# EAGLE design prvosienka (EAGLE 9.5.2)
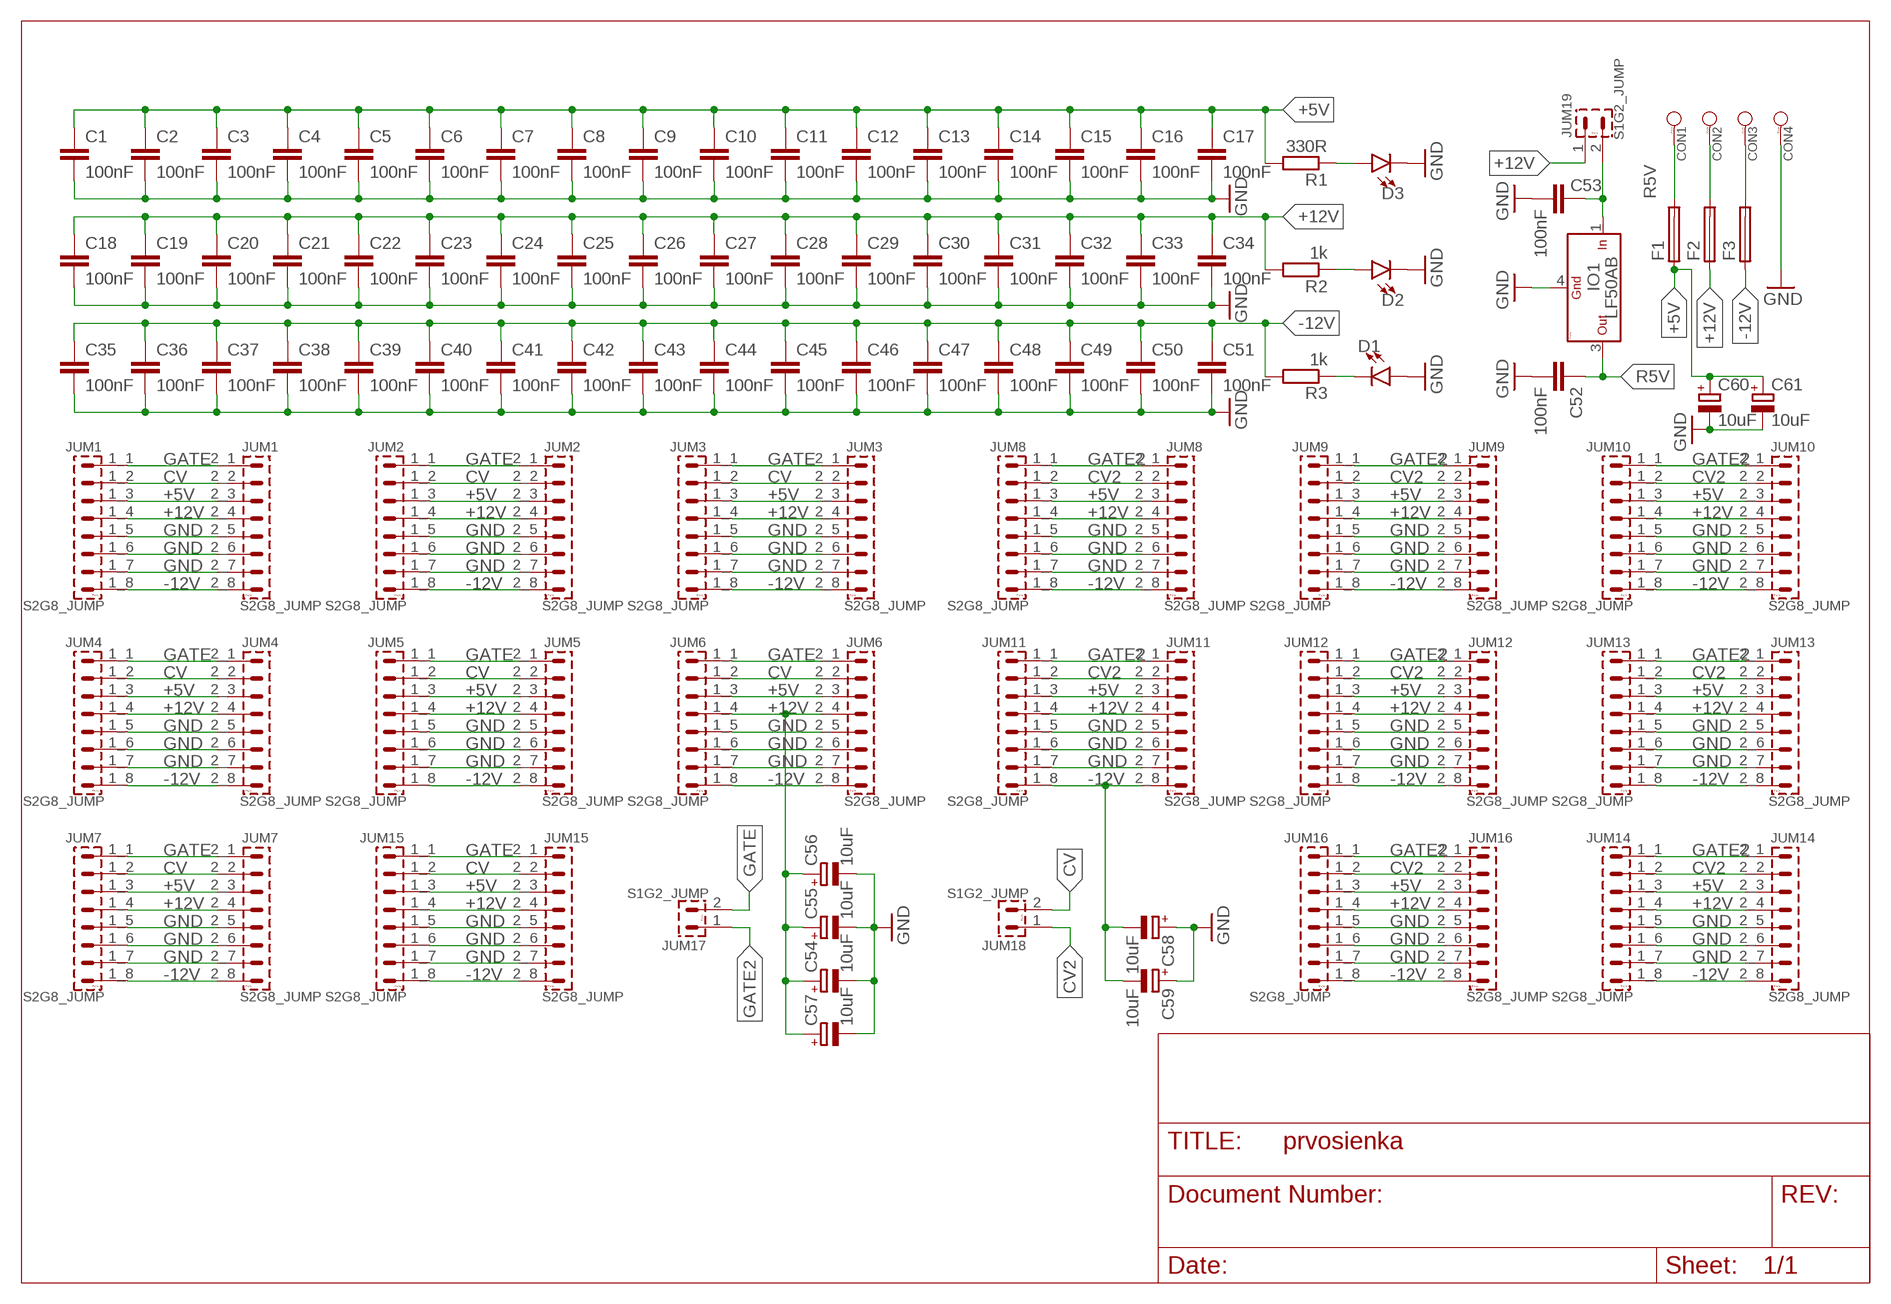
[diagram p0: schematic, sheet 1]

## Parts
C1  100nF  C-EUC0603K  [C0603K]
C2  100nF  C-EUC0603K  [C0603K]
C3  100nF  C-EUC0603K  [C0603K]
C4  100nF  C-EUC0603K  [C0603K]
C5  100nF  C-EUC0603K  [C0603K]
C6  100nF  C-EUC0603K  [C0603K]
C7  100nF  C-EUC0603K  [C0603K]
C8  100nF  C-EUC0603K  [C0603K]
C9  100nF  C-EUC0603K  [C0603K]
C10  100nF  C-EUC0603K  [C0603K]
C11  100nF  C-EUC0603K  [C0603K]
C12  100nF  C-EUC0603K  [C0603K]
C13  100nF  C-EUC0603K  [C0603K]
C14  100nF  C-EUC0603K  [C0603K]
C15  100nF  C-EUC0603K  [C0603K]
C16  100nF  C-EUC0603K  [C0603K]
C17  100nF  C-EUC0603K  [C0603K]
C18  100nF  C-EUC0603K  [C0603K]
C19  100nF  C-EUC0603K  [C0603K]
C20  100nF  C-EUC0603K  [C0603K]
C21  100nF  C-EUC0603K  [C0603K]
C22  100nF  C-EUC0603K  [C0603K]
C23  100nF  C-EUC0603K  [C0603K]
C24  100nF  C-EUC0603K  [C0603K]
C25  100nF  C-EUC0603K  [C0603K]
C26  100nF  C-EUC0603K  [C0603K]
C27  100nF  C-EUC0603K  [C0603K]
C28  100nF  C-EUC0603K  [C0603K]
C29  100nF  C-EUC0603K  [C0603K]
C30  100nF  C-EUC0603K  [C0603K]
C31  100nF  C-EUC0603K  [C0603K]
C32  100nF  C-EUC0603K  [C0603K]
C33  100nF  C-EUC0603K  [C0603K]
C34  100nF  C-EUC0603K  [C0603K]
C35  100nF  C-EUC0603K  [C0603K]
C36  100nF  C-EUC0603K  [C0603K]
C37  100nF  C-EUC0603K  [C0603K]
C38  100nF  C-EUC0603K  [C0603K]
C39  100nF  C-EUC0603K  [C0603K]
C40  100nF  C-EUC0603K  [C0603K]
C41  100nF  C-EUC0603K  [C0603K]
C42  100nF  C-EUC0603K  [C0603K]
C43  100nF  C-EUC0603K  [C0603K]
C44  100nF  C-EUC0603K  [C0603K]
C45  100nF  C-EUC0603K  [C0603K]
C46  100nF  C-EUC0603K  [C0603K]
C47  100nF  C-EUC0603K  [C0603K]
C48  100nF  C-EUC0603K  [C0603K]
C49  100nF  C-EUC0603K  [C0603K]
C50  100nF  C-EUC0603K  [C0603K]
C51  100nF  C-EUC0603K  [C0603K]
C52  100nF  C-EUC0603K  [C0603K]
C53  100nF  C-EUC0603K  [C0603K]
C54  10uF  CPOL-EUB  [PANASONIC_B]
C55  10uF  CPOL-EUB  [PANASONIC_B]
C56  10uF  CPOL-EUB  [PANASONIC_B]
C57  10uF  CPOL-EUB  [PANASONIC_B]
C58  10uF  CPOL-EUB  [PANASONIC_B]
C59  10uF  CPOL-EUB  [PANASONIC_B]
C60  10uF  CPOL-EUB  [PANASONIC_B]
C61  10uF  CPOL-EUB  [PANASONIC_B]
CON1  WAGO256  [WAGO256]
CON2  WAGO256  [WAGO256]
CON3  WAGO256  [WAGO256]
CON4  WAGO256  [WAGO256]
D1  LED0603  [LED-0603]
D2  LED0603  [LED-0603]
D3  LED0603  [LED-0603]
F1  TE5  [TE5]
F2  TE5  [TE5]
F3  TE5  [TE5]
IO1  LF50AB  78M  [DPAK]
JUM1  S2G8_JUMP  [S2G8_JUM]
JUM2  S2G8_JUMP  [S2G8_JUM]
JUM3  S2G8_JUMP  [S2G8_JUM]
JUM4  S2G8_JUMP  [S2G8_JUM]
JUM5  S2G8_JUMP  [S2G8_JUM]
JUM6  S2G8_JUMP  [S2G8_JUM]
JUM7  S2G8_JUMP  [S2G8_JUM]
JUM8  S2G8_JUMP  [S2G8_JUM]
JUM9  S2G8_JUMP  [S2G8_JUM]
JUM10  S2G8_JUMP  [S2G8_JUM]
JUM11  S2G8_JUMP  [S2G8_JUM]
JUM12  S2G8_JUMP  [S2G8_JUM]
JUM13  S2G8_JUMP  [S2G8_JUM]
JUM14  S2G8_JUMP  [S2G8_JUM]
JUM15  S2G8_JUMP  [S2G8_JUM]
JUM16  S2G8_JUMP  [S2G8_JUM]
JUM17  S1G2_JUMP  [S1G2_JUM]
JUM18  S1G2_JUMP  [S1G2_JUM]
JUM19  S1G2_JUMP  [S1G2_JUM]
R1  330R  R-EU_R0603  [R0603]
R2  1k  R-EU_R0603  [R0603]
R3  1k  R-EU_R0603  [R0603]

## Nets
+5V: C1.1 C2.1 C3.1 C4.1 C5.1 C6.1 C7.1 C8.1 C9.1 C10.1 C11.1 C12.1 C13.1 C14.1 C15.1 C16.1 C17.1 C60.+ C61.+ F1.1 JUM1.1_3 JUM1.2_3 JUM2.1_3 JUM2.2_3 JUM3.1_3 JUM3.2_3 JUM4.1_3 JUM4.2_3 JUM5.1_3 JUM5.2_3 JUM6.1_3 JUM6.2_3 JUM7.1_3 JUM7.2_3 JUM8.1_3 JUM8.2_3 JUM9.1_3 JUM9.2_3 JUM10.1_3 JUM10.2_3 JUM11.1_3 JUM11.2_3 JUM12.1_3 JUM12.2_3 JUM13.1_3 JUM13.2_3 JUM14.1_3 JUM14.2_3 JUM15.1_3 JUM15.2_3 JUM16.1_3 JUM16.2_3 R1.2
+12V: C18.1 C19.1 C20.1 C21.1 C22.1 C23.1 C24.1 C25.1 C26.1 C27.1 C28.1 C29.1 C30.1 C31.1 C32.1 C33.1 C34.1 C54.+ C55.+ C56.+ C57.+ F2.1 JUM1.1_4 JUM1.2_4 JUM2.1_4 JUM2.2_4 JUM3.1_4 JUM3.2_4 JUM4.1_4 JUM4.2_4 JUM5.1_4 JUM5.2_4 JUM6.1_4 JUM6.2_4 JUM7.1_4 JUM7.2_4 JUM8.1_4 JUM8.2_4 JUM9.1_4 JUM9.2_4 JUM10.1_4 JUM10.2_4 JUM11.1_4 JUM11.2_4 JUM12.1_4 JUM12.2_4 JUM13.1_4 JUM13.2_4 JUM14.1_4 JUM14.2_4 JUM15.1_4 JUM15.2_4 JUM16.1_4 JUM16.2_4 JUM19.1 R2.2
-12V: C35.1 C36.1 C37.1 C38.1 C39.1 C40.1 C41.1 C42.1 C43.1 C44.1 C45.1 C46.1 C47.1 C48.1 C49.1 C50.1 C51.1 C58.- C59.- F3.1 JUM1.1_8 JUM1.2_8 JUM2.1_8 JUM2.2_8 JUM3.1_8 JUM3.2_8 JUM4.1_8 JUM4.2_8 JUM5.1_8 JUM5.2_8 JUM6.1_8 JUM6.2_8 JUM7.1_8 JUM7.2_8 JUM8.1_8 JUM8.2_8 JUM9.1_8 JUM9.2_8 JUM10.1_8 JUM10.2_8 JUM11.1_8 JUM11.2_8 JUM12.1_8 JUM12.2_8 JUM13.1_8 JUM13.2_8 JUM14.1_8 JUM14.2_8 JUM15.1_8 JUM15.2_8 JUM16.1_8 JUM16.2_8 R3.2
CV: JUM1.1_2 JUM1.2_2 JUM2.1_2 JUM2.2_2 JUM3.1_2 JUM3.2_2 JUM4.1_2 JUM4.2_2 JUM5.1_2 JUM5.2_2 JUM6.1_2 JUM6.2_2 JUM7.1_2 JUM7.2_2 JUM15.1_2 JUM15.2_2 JUM18.2
CV2: JUM8.1_2 JUM8.2_2 JUM9.1_2 JUM9.2_2 JUM10.1_2 JUM10.2_2 JUM11.1_2 JUM11.2_2 JUM12.1_2 JUM12.2_2 JUM13.1_2 JUM13.2_2 JUM14.1_2 JUM14.2_2 JUM16.1_2 JUM16.2_2 JUM18.1
GATE: JUM1.1_1 JUM1.2_1 JUM2.1_1 JUM2.2_1 JUM3.1_1 JUM3.2_1 JUM4.1_1 JUM4.2_1 JUM5.1_1 JUM5.2_1 JUM6.1_1 JUM6.2_1 JUM7.1_1 JUM7.2_1 JUM15.1_1 JUM15.2_1 JUM17.2
GATE2: JUM8.1_1 JUM8.2_1 JUM9.1_1 JUM9.2_1 JUM10.1_1 JUM10.2_1 JUM11.1_1 JUM11.2_1 JUM12.1_1 JUM12.2_1 JUM13.1_1 JUM13.2_1 JUM14.1_1 JUM14.2_1 JUM16.1_1 JUM16.2_1 JUM17.1
GND: C1.2 C2.2 C3.2 C4.2 C5.2 C6.2 C7.2 C8.2 C9.2 C10.2 C11.2 C12.2 C13.2 C14.2 C15.2 C16.2 C17.2 C18.2 C19.2 C20.2 C21.2 C22.2 C23.2 C24.2 C25.2 C26.2 C27.2 C28.2 C29.2 C30.2 C31.2 C32.2 C33.2 C34.2 C35.2 C36.2 C37.2 C38.2 C39.2 C40.2 C41.2 C42.2 C43.2 C44.2 C45.2 C46.2 C47.2 C48.2 C49.2 C50.2 C51.2 C52.2 C53.2 C54.- C55.- C56.- C57.- C58.+ C59.+ C60.- C61.- CON4.1 D1.A D2.C D3.C IO1.4(GND) JUM1.1_5 JUM1.1_6 JUM1.1_7 JUM1.2_5 JUM1.2_6 JUM1.2_7 JUM2.1_5 JUM2.1_6 JUM2.1_7 JUM2.2_5 JUM2.2_6 JUM2.2_7 JUM3.1_5 JUM3.1_6 JUM3.1_7 JUM3.2_5 JUM3.2_6 JUM3.2_7 JUM4.1_5 JUM4.1_6 JUM4.1_7 JUM4.2_5 JUM4.2_6 JUM4.2_7 JUM5.1_5 JUM5.1_6 JUM5.1_7 JUM5.2_5 JUM5.2_6 JUM5.2_7 JUM6.1_5 JUM6.1_6 JUM6.1_7 JUM6.2_5 JUM6.2_6 JUM6.2_7 JUM7.1_5 JUM7.1_6 JUM7.1_7 JUM7.2_5 JUM7.2_6 JUM7.2_7 JUM8.1_5 JUM8.1_6 JUM8.1_7 JUM8.2_5 JUM8.2_6 JUM8.2_7 JUM9.1_5 JUM9.1_6 JUM9.1_7 JUM9.2_5 JUM9.2_6 JUM9.2_7 JUM10.1_5 JUM10.1_6 JUM10.1_7 JUM10.2_5 JUM10.2_6 JUM10.2_7 JUM11.1_5 JUM11.1_6 JUM11.1_7 JUM11.2_5 JUM11.2_6 JUM11.2_7 JUM12.1_5 JUM12.1_6 JUM12.1_7 JUM12.2_5 JUM12.2_6 JUM12.2_7 JUM13.1_5 JUM13.1_6 JUM13.1_7 JUM13.2_5 JUM13.2_6 JUM13.2_7 JUM14.1_5 JUM14.1_6 JUM14.1_7 JUM14.2_5 JUM14.2_6 JUM14.2_7 JUM15.1_5 JUM15.1_6 JUM15.1_7 JUM15.2_5 JUM15.2_6 JUM15.2_7 JUM16.1_5 JUM16.1_6 JUM16.1_7 JUM16.2_5 JUM16.2_6 JUM16.2_7
N$1: D3.A R1.1
N$2: D2.A R2.1
N$3: D1.C R3.1
N$4: CON3.1 F3.2
N$5: CON2.1 F2.2
N$7: C53.1 IO1.1(IN) JUM19.2
R5V: C52.1 CON1.1 F1.2 IO1.3(OUT)

## Library data of the parts
C1-C53 = resistor:C-EU: CAPACITOR, European symbol
C54-C61 = resistor:CPOL-EU: POLARIZED CAPACITOR, European symbol
CON1-CON4 = #PaJa_konektory:WAGO256: Konektor WAGO - RM 5,08mm - s packou
D1-D3 = SparkFun-LED:LED: LED (Generic) Standard schematic elements and footprints for 5mm, 3mm, 1206, and 0603 sized LEDs. Generic LEDs with no color specified.
F1-F3 = fuse:TE5: FUSE Wickmann; OC_FARNELL: unknown; OC_NEWARK: unknown
IO1 = #PaJa_31:78?: Stabilizator - 1A a 1,5A ? - napeti => 05, 06, 08, 09, 12, 15, 18, 20, 24 => 1,5A ? - napeti => 10, 12, 15, 18 => 1A S ? - napeti => 05, 09, 10, 12, 15, 18, 24 => 2A T ? - napeti => 05 => 3A ------------------------------------------------------- Stabilizator - 100mA (TO-92 , SOT-89) ? - napeti => 02, 05, 06, 08, 09, 12, 15, 18
JUM1-JUM16 = #PaJa_konektory:S2G8_JUMP: Radove konektory - koliky - dvojite - 2x8
JUM17-JUM19 = #PaJa_konektory:S1G2_JUMP: Radove konektory - koliky - 2x
R1-R3 = resistor:R-EU_: RESISTOR, European symbol

## Board
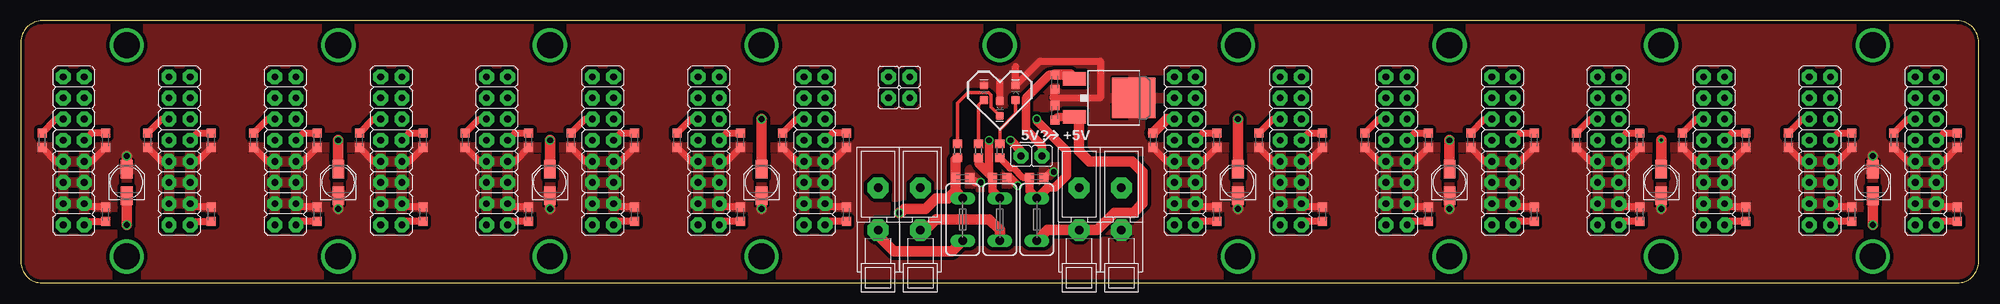
[diagram p1: board, top side]
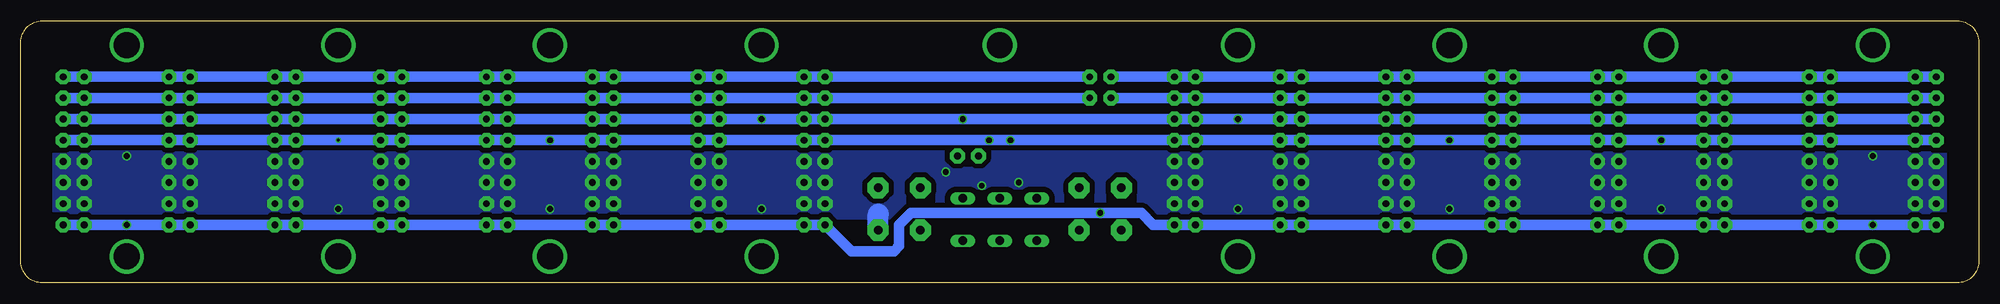
[diagram p2: board, bottom side, seen from below]

Size 234.95 x 31.5 mm. Coordinates in mm from the lower left corner, seen from the top.
Outline: 232.41,31.5 2.54,31.5 arc90 0,28.96 0,2.54 arc90 2.54,0 232.41,0 arc90 234.95,2.54 234.95,28.96 arc90 232.41,31.5
Copper layers (1*16): Top 0.035mm / dielectric 1.5mm / Bottom 0.035mm
Design rules "SeeedStudio_2layer_DRU_no_angle_20140221": minimum track width 6mil, minimum drill 12mil, track to track 6mil, track to pad 6mil, pad to pad 6mil, via to via 6mil, smd to smd 0mil, copper to edge 10mil, drill to drill 10mil, minimum pad ring 10mil, minimum via ring 6mil, stop-mask expansion 2mil, vias tented up to drill 100mil, thermal gap 10mil

### Footprints (pad centres in the part's own frame; a part is rotated, then mirrored left to right if it is on the bottom)
C0603K = smd 1.05 x 1.08: 1 -0.875,0; 2 0.875,0
PANASONIC_B = smd 2.2 x 1.4: + 1.6,0; - -1.6,0
WAGO256 = drill 1.016 pad 2.54 octagon: 1 0,0; A1 -5.08,0
LED-0603 = smd 1 x 1: A -0.877,0; C 0.877,0
TE5 = drill 1.016 long: 1 -2.54,0; 2 2.54,0
DPAK = smd 1.6 x 2.8: 1 -2.28,-4.992; 3 2.28,-4.992 | smd 4.826 x 5.191: 4 0,2.096
S2G8_JUM = drill 0.813 pad 1.778 octagon: 1_1 -8.89,-1.27; 1_2 -6.35,-1.27; 1_3 -3.81,-1.27; 1_4 -1.27,-1.27; 1_5 1.27,-1.27; 1_6 3.81,-1.27; 1_7 6.35,-1.27; 1_8 8.89,-1.27; 2_1 -8.89,1.27; 2_2 -6.35,1.27; 2_3 -3.81,1.27; 2_4 -1.27,1.27; 2_5 1.27,1.27; 2_6 3.81,1.27; 2_7 6.35,1.27; 2_8 8.89,1.27
S1G2_JUM = drill 0.813 pad 1.778 octagon: 1 -1.27,0; 2 1.27,0
R0603 = smd 1 x 1.1: 1 -0.85,0; 2 0.85,0

### Placement (x,y rotation side)
C1  2.54,17.14 270 top
C2  15.24,17.14 270 top
C3  27.94,17.14 270 top
C4  40.64,17.14 270 top
C5  53.34,17.14 270 top
C6  66.04,17.14 270 top
C7  78.74,17.14 270 top
C8  91.44,17.14 270 top
C9  135.89,17.14 270 top
C10  148.59,17.14 270 top
C11  161.29,17.14 270 top
C12  173.99,17.14 270 top
C13  186.69,17.14 270 top
C14  199.39,17.14 270 top
C15  212.09,17.14 270 top
C16  224.79,17.14 270 top
C17  121.92,12.7 0 top
C18  10.16,17.14 270 top
C19  22.86,17.14 270 top
C20  35.56,17.14 270 top
C21  48.26,17.14 270 top
C22  60.96,17.14 270 top
C23  73.66,17.14 270 top
C24  86.36,17.14 270 top
C25  99.06,17.14 270 top
C26  143.51,17.14 270 top
C27  156.21,17.14 270 top
C28  168.91,17.14 270 top
C29  181.61,17.14 270 top
C30  194.31,17.14 270 top
C31  207.01,17.14 270 top
C32  219.71,17.14 270 top
C33  232.41,17.14 270 top
C34  117.47,12.7 0 top
C35  10.16,8.26 90 top
C36  22.86,8.26 90 top
C37  35.56,8.26 90 top
C38  48.26,8.26 90 top
C39  60.96,8.26 90 top
C40  73.66,8.26 90 top
C41  86.36,8.26 90 top
C42  99.06,8.26 90 top
C43  143.51,8.26 90 top
C44  156.21,8.26 90 top
C45  168.91,8.26 90 top
C46  181.61,8.26 90 top
C47  194.31,8.26 90 top
C48  207.01,8.26 90 top
C49  219.71,8.26 90 top
C50  232.41,8.26 90 top
C51  113.03,12.7 0 top
C52  124.08,20.45 90 top
C53  124.08,24.13 270 top
C54  171.45,12.06 90 top
C55  63.5,12.06 90 top
C56  38.1,12.06 90 top
C57  196.85,12.06 90 top
C58  12.7,12.06 90 top
C59  222.25,12.06 90 top
C60  88.9,12.06 90 top
C61  146.05,12.06 90 top
CON1  127,6.35 270 top
CON2  107.95,6.35 270 top
CON3  102.87,6.35 270 top
CON4  132.08,6.35 270 top
D1  117.47,20.95 270 top
D2  115.57,22.86 90 top
D3  119.38,22.86 90 top
F1  121.92,7.62 270 top
F2  117.47,7.62 270 top
F3  113.03,7.62 270 top
IO1  131.44,22.23 270 top
JUM1  95.25,15.88 270 top
JUM2  82.55,15.88 270 top
JUM3  69.85,15.88 270 top
JUM4  57.15,15.88 270 top
JUM5  44.45,15.88 270 top
JUM6  31.75,15.88 270 top
JUM7  19.05,15.88 270 top
JUM8  152.4,15.88 270 top
JUM9  228.6,15.88 270 top
JUM10  215.9,15.88 270 top
JUM11  203.2,15.88 270 top
JUM12  190.5,15.88 270 top
JUM13  177.8,15.88 270 top
JUM14  165.1,15.88 270 top
JUM15  6.35,15.88 270 top
JUM16  139.7,15.88 270 top
JUM17  105.41,24.77 180 top
JUM18  105.41,22.23 180 top
JUM19  121.28,15.24 0 top
R1  117.47,15.88 270 top
R2  114.94,15.88 270 top
R3  112.39,15.88 270 top

### Tracks (layer width: path | path; a pad name or v marks a point on that pad's centre or on a via)
+5V  (via drill 0.7)
  Top 0.813: C1.1 4.21,19.68 JUM15.1_3 | C2.1 16.91,19.68 JUM7.1_3 | C8.1 93.11,19.68 JUM1.1_3 | C7.1 80.41,19.68 JUM2.1_3 | C6.1 67.7,19.68 JUM3.1_3 | C5.1 55.01,19.68 JUM4.1_3 | C4.1 42.3,19.68 JUM5.1_3 | C3.1 29.61,19.68 JUM6.1_3 | C16.1 226.46,19.68 JUM9.1_3 | C15.1 213.75,19.68 JUM10.1_3 | C14.1 201.06,19.68 JUM11.1_3 | C13.1 188.35,19.68 JUM12.1_3 | C12.1 175.66,19.68 JUM13.1_3 | C11.1 162.96,19.68 JUM14.1_3 | C10.1 150.25,19.68 JUM8.1_3 | R1.2 118.7,13.8 119.11,13.8 120.2,12.7 C17.1
  Top 1.016: C17.1 121.05,11.04 F1.1 123.26,11.5 124.13,11.5 125.52,12.89 125.52,15.83 121.92,19.43 v121.92,19.68
  Top 1.27: C60.+ v88.9,19.68 | C61.+ v146.05,19.68 | 122.56,10.16 F1.1 | C9.1 137.56,19.68 JUM16.1_3
  Bottom 1.27: JUM15.1_3 JUM15.2_3 JUM7.1_3 JUM7.2_3 JUM6.1_3 JUM6.2_3 JUM5.1_3 JUM5.2_3 JUM4.1_3 JUM4.2_3 JUM3.1_3 JUM3.2_3 JUM2.1_3 JUM2.2_3 v88.9,19.68 JUM1.1_3 JUM1.2_3 v121.92,19.68 JUM16.1_3 JUM16.2_3 v146.05,19.68 JUM8.1_3 JUM8.2_3 JUM14.1_3 JUM14.2_3 JUM13.1_3 JUM13.2_3 JUM12.1_3 JUM12.2_3 JUM11.1_3 JUM11.2_3 JUM10.1_3 JUM10.2_3 JUM9.1_3 JUM9.2_3
+12V  (via drill 0.35, 0.7)
  Top 0.813: C18.1 8.49,18.02 JUM15.2_4 | JUM7.2_4 21.2,18.02 C19.1 | JUM6.2_4 33.9,18.02 C20.1 | JUM5.2_4 46.59,18.02 C21.1 | JUM4.2_4 59.3,18.02 C22.1 | JUM3.2_4 72,18.02 C23.1 | JUM2.2_4 84.69,18.02 C24.1 | JUM9.2_4 230.75,18.02 C33.1 | JUM10.2_4 218.04,18.02 C32.1 | JUM11.2_4 205.34,18.02 C31.1 | JUM12.2_4 192.65,18.02 C30.1 | JUM13.2_4 179.94,18.02 C29.1 | JUM14.2_4 167.25,18.02 C28.1 | JUM8.2_4 154.54,18.02 C27.1 | JUM16.2_4 141.84,18.02 C26.1 | 114.94,14.37 R2.2 | C25.1 97.39,18.02 JUM1.2_4
  Top 1.016: F2.1 116.6,11.04 C34.1 | C34.1 114.94,14.37 | C34.1 116.2,13.1 v116.2,17.14 | v118.75,17.14 120.02,15.88 JUM19.1
  Top 1.27: C55.+ v63.5,17.14 | C54.+ v171.45,17.14 | C57.+ v196.85,17.14 | C56.+ v38.1,17.14
  Bottom 1.27: JUM15.1_4 JUM15.2_4 JUM7.1_4 JUM7.2_4 JUM6.1_4 JUM6.2_4 v38.1,17.14 JUM5.1_4 JUM5.2_4 JUM4.1_4 JUM4.2_4 v63.5,17.14 JUM3.1_4 JUM3.2_4 JUM2.1_4 JUM2.2_4 JUM1.1_4 JUM1.2_4 v116.2,17.14 v118.75,17.14 JUM16.1_4 JUM16.2_4 JUM8.1_4 JUM8.2_4 JUM14.1_4 JUM14.2_4 v171.45,17.14 JUM13.1_4 JUM13.2_4 JUM12.1_4 JUM12.2_4 v196.85,17.14 JUM11.1_4 JUM11.2_4 JUM10.1_4 JUM10.2_4 JUM9.1_4 JUM9.2_4
-12V  (via drill 0.7)
  Top 0.813: JUM15.2_8 8.02,7.38 C35.1 | JUM7.2_8 arc-90 20.71,7.38 C36.1 | C37.1 33.41,7.38 JUM6.2_8 | C38.1 46.12,7.38 JUM5.2_8 | C39.1 58.81,7.38 JUM4.2_8 | C40.1 71.52,7.38 JUM3.2_8 | C41.1 84.22,7.38 JUM2.2_8 | C42.1 96.92,7.38 JUM1.2_8 | C43.1 141.37,7.38 JUM16.2_8 | C44.1 154.06,7.38 JUM8.2_8 | C45.1 166.76,7.38 JUM14.2_8 | C46.1 179.47,7.38 JUM13.2_8 | C47.1 192.16,7.38 JUM12.2_8 | C48.1 204.87,7.38 JUM11.2_8 | C49.1 217.56,7.38 JUM10.2_8 | C50.1 230.26,7.38 JUM9.2_8
  Top 1.27: C58.- v12.7,6.99 | C59.- v222.25,6.99 | R3.2 112.16,14.79 C51.1 112.16,11.04 | F3.1 112.16,11.04 | 112.16,11.04 111.28,10.16 109.86,10.16 108.58,8.89 106.05,8.89 105.56,8.41 v105.41,8.41
  Bottom 1.27: JUM15.1_8 JUM15.2_8 v12.7,6.99 JUM7.1_8 JUM7.2_8 JUM6.1_8 JUM6.2_8 JUM5.1_8 JUM5.2_8 JUM4.1_8 JUM4.2_8 JUM3.1_8 JUM3.2_8 JUM2.1_8 JUM2.2_8 JUM1.1_8 JUM1.2_8 99.06,6.99 100.48,8.41 v105.41,8.41 128.12,8.41 129.54,6.99 129.54,4.45 130.18,3.81 135.25,3.81 JUM16.1_8 JUM16.2_8 JUM8.1_8 JUM8.2_8 JUM14.1_8 JUM14.2_8 JUM13.1_8 JUM13.2_8 JUM12.1_8 JUM12.2_8 JUM11.1_8 JUM11.2_8 JUM10.1_8 JUM10.2_8 v222.25,6.99 JUM9.1_8 JUM9.2_8
CV
  Bottom 1.27: JUM15.1_2 JUM15.2_2 JUM7.1_2 JUM7.2_2 JUM6.1_2 JUM6.2_2 JUM5.1_2 JUM5.2_2 JUM4.1_2 JUM4.2_2 JUM3.1_2 JUM3.2_2 JUM2.1_2 JUM2.2_2 JUM1.1_2 JUM1.2_2 JUM18.2
CV2
  Bottom 1.27: JUM18.1 JUM16.1_2 JUM16.2_2 JUM8.1_2 JUM8.2_2 JUM14.1_2 JUM14.2_2 JUM13.1_2 JUM13.2_2 JUM12.1_2 JUM12.2_2 JUM11.1_2 JUM11.2_2 JUM10.1_2 JUM10.2_2 JUM9.1_2 JUM9.2_2
GATE
  Bottom 1.27: JUM15.1_1 JUM15.2_1 JUM7.1_1 JUM7.2_1 JUM6.1_1 JUM6.2_1 JUM5.1_1 JUM5.2_1 JUM4.1_1 JUM4.2_1 JUM3.1_1 JUM3.2_1 JUM2.1_1 JUM2.2_1 JUM1.1_1 JUM1.2_1 JUM17.2
GATE2
  Bottom 0.813: 154.94,24.77 JUM8.2_1
  Bottom 1.27: JUM17.1 JUM16.1_1 JUM16.2_1 JUM8.1_1 JUM8.2_1 JUM14.1_1 JUM14.2_1 JUM13.1_1 JUM13.2_1 JUM12.1_1 JUM12.2_1 JUM11.1_1 JUM11.2_1 JUM10.1_1 JUM10.2_1 JUM9.1_1 JUM9.2_1
GND  (via drill 0.7)
  Top 0.61: C17.2 123.43,13.34 v123.95,13.34
  Top 0.813: C1.2 4.21,14.61 JUM15.1_5 | JUM15.2_5 8.49,14.61 C18.2 | C2.2 16.91,14.61 JUM7.1_5 | C19.2 21.2,14.61 JUM7.2_5 | C3.2 29.61,14.61 JUM6.1_5 | C20.2 33.9,14.61 JUM6.2_5 | C4.2 42.3,14.61 JUM5.1_5 | C21.2 46.59,14.61 JUM5.2_5 | C5.2 55.01,14.61 JUM4.1_5 | C22.2 59.3,14.61 JUM4.2_5 | C6.2 67.7,14.61 JUM3.1_5 | C23.2 72,14.61 JUM3.2_5 | C7.2 80.41,14.61 JUM2.1_5 | C24.2 84.69,14.61 JUM2.2_5 | C8.2 93.11,14.61 JUM1.1_5 | C25.2 97.39,14.61 JUM1.2_5 | C10.2 150.25,14.61 JUM8.1_5 | C27.2 154.54,14.61 JUM8.2_5 | C11.2 162.96,14.61 JUM14.1_5 | C28.2 167.25,14.61 JUM14.2_5 | C12.2 175.66,14.61 JUM13.1_5 | C13.2 188.35,14.61 JUM12.1_5 | C29.2 179.94,14.61 JUM13.2_5 | JUM12.2_5 192.65,14.61 C30.2 | JUM11.1_5 201.06,14.61 C14.2 | C31.2 205.34,14.61 JUM11.2_5 | C15.2 213.75,14.61 JUM10.1_5 | C32.2 218.04,14.61 JUM10.2_5 | C16.2 226.46,14.61 JUM9.1_5 | C33.2 230.75,14.61 JUM9.2_5 | C26.2 141.84,14.61 JUM16.2_5 | C9.2 137.56,14.61 JUM16.1_5 | C35.2 8.02,9.13 JUM15.2_7 | C36.2 20.71,9.13 JUM7.2_7 | C37.2 33.41,9.13 JUM6.2_7 | C38.2 46.12,9.13 JUM5.2_7 | C39.2 58.81,9.13 JUM4.2_7 | C40.2 71.52,9.13 JUM3.2_7 | C41.2 84.22,9.13 JUM2.2_7 | C42.2 96.92,9.13 JUM1.2_7 | C43.2 141.37,9.13 JUM16.2_7 | C44.2 154.06,9.13 JUM8.2_7 | C45.2 166.76,9.13 JUM14.2_7 | C46.2 179.47,9.13 JUM13.2_7 | C47.2 192.16,9.13 JUM12.2_7 | C48.2 204.87,9.13 JUM11.2_7 | C49.2 217.56,9.13 JUM10.2_7 | C50.2 230.26,9.13 JUM9.2_7 | D1.A 117.47,24.13 | 119.38,24.77 D3.C | D3.C 119.38,26.04 | C53.2 123.83,22.23 129.54,22.23 129.54,26.67 122.31,26.67 D3.C
  Top 1.016: C51.2 114.54,12.06 v115.19,12.06 | v119.63,11.68 118.62,12.7 C34.2
  Top 1.27: C61.- v146.05,8.89 | C54.- v171.45,8.89 | C57.- v196.85,8.89 | C59.+ v222.25,15.24 | C60.- v88.9,8.89 | C55.- v63.5,8.89 | C56.- v38.1,8.89 | C58.+ v12.7,15.24
  Bottom 2.54: CON4.1 132.08,8.26
  pour Bottom (isolate 0.61, no thermals): 4.45,17.14 230.5,17.14 230.5,8.26 4.45,8.26
  pour Top (isolate 0.406): 0,31.11 234.95,31.11 234.95,0 0,0
N$1
  Top 0.406: D3.A 119.38,20.32 117.47,18.41 R1.1
N$2
  Top 0.406: D2.A 114.94,21.35 R2.1
N$3
  Top 0.406: R3.1 112.39,21.59 113.67,22.86 116.11,22.86 116.43,22.54 116.43,21.13 D1.C
N$4
  Top 1.27: CON3.1 102.87,5.71 104.78,3.81 111.76,3.81 F3.2
N$5
  Top 1.27: CON2.1 108.58,6.35 109.86,7.62 116.2,7.62 117.47,6.35 F2.2
N$6  (via drill 3.1)
  other vias: 88.9,3.17
N$7
  Top 1.016: JUM19.2 122.56,16.51 120.65,18.41 120.65,22.23 123.43,25 C53.1
  Top 1.27: IO1.1 125.95,25 C53.1
N$8  (via drill 3.1)
  other vias: 63.5,3.17
N$9  (via drill 3.1)
  other vias: 38.1,3.17
N$10  (via drill 3.1)
  other vias: 12.7,3.17
N$11  (via drill 3.1)
  other vias: 12.7,28.57
N$12  (via drill 3.1)
  other vias: 38.1,28.57
N$13  (via drill 3.1)
  other vias: 63.5,28.57
N$14  (via drill 3.1)
  other vias: 88.9,28.57
N$15  (via drill 3.1)
  other vias: 146.05,28.57
N$16  (via drill 3.1)
  other vias: 171.45,28.57
N$17  (via drill 3.1)
  other vias: 196.85,28.57
N$18  (via drill 3.1)
  other vias: 222.25,28.57
N$19  (via drill 3.1)
  other vias: 146.05,3.17
N$20  (via drill 3.1)
  other vias: 171.45,3.17
N$21  (via drill 3.1)
  other vias: 196.85,3.17
N$22  (via drill 3.1)
  other vias: 222.25,3.17
N$23  (via drill 3.1)
  other vias: 117.47,28.57
R5V
  Top 1.016: C52.1 124.45,19.95 IO1.3
  Top 1.27: F1.2 123.19,6.35 CON1.1 129.17,6.35 131.23,8.41 133.5,8.41 134.62,9.53 134.62,13.34 133.35,14.61 128.27,14.61 127,15.88 127,19.4 IO1.3

### Text on the board
tPlace: 5V? | +5V
tStop: Join? | -12V | +12V | GND | S | U | Z | V | U | K | R. Stefun 2017 | Eurorack Bus Board | prvosienka
bStop: GATE | CV | +5V | +12V | GND | -12V